# Altium schematic sheet Boost Converter.SchDoc
size A; SheetNumber: 5; SheetTotal: 5
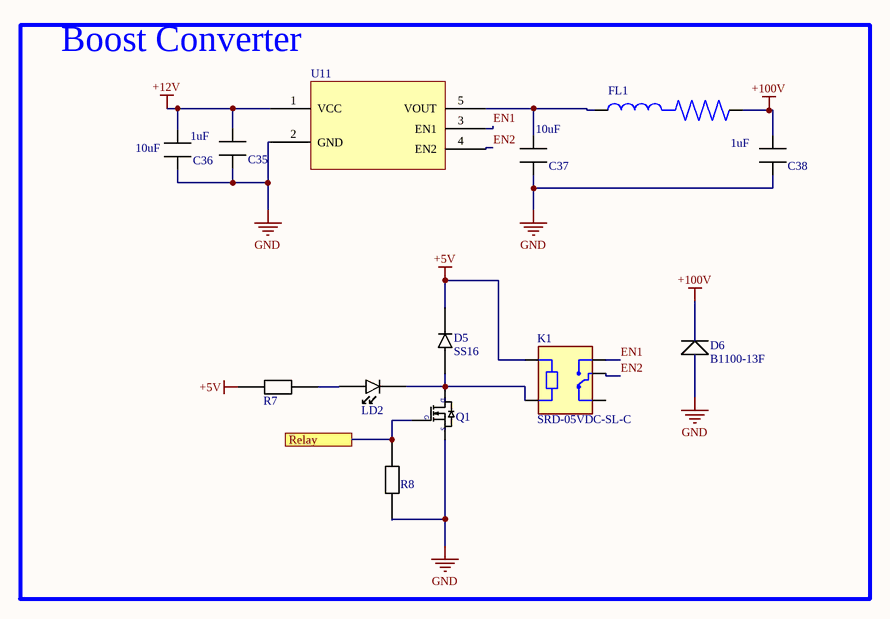
[diagram p0: Boost Converter.SchDoc]

## Parts
C35  1uF  [CAP_1206]
C36  10uF  [CAP_0805]
C37  10uF  [CAP_1206]
C38  1uF  [CAP_1206]
D5  SS16  [DO-214AC]
D6  B1100-13F  [DIOM5226X230N]
FL1  (no value)  [BEAD1206S601A40T]
K1  SRD-05VDC-SL-C  [RELAY_SRD-05VDC-SL-C]
LD2  LED_0805  [LED_0805]  (value not drawn)
Q1  DMN3404L-7  [SOT23-3]  (value not drawn)
R7  330  [RES_0805]  (value not drawn)
R8  4.7k  [RES_0805]  (value not drawn)
U11  Boost_Conv_Module  [Boost_Converter]  (value not drawn)

## Blocks framed on the sheet
Boost Converter: C35-C38 D5 D6 FL1 K1 LD2 Q1 R7 R8 U11

## Ports
Relay

## Nets
+5V: D5.1 K1.A1 R7.2
+12V: C35.2 C36.2 U11.1(VCC)
+100V: C38.2 D6.1(-) FL1.2
GND: C35.1 C36.1 C37.1 C38.1 D6.2(+) Q1.2 R8.1 U11.2(GND)
EN1: K1.NO U11.3(EN1)
EN2: K1.COM U11.4(EN2)
Relay: Q1.1 R8.2 ; port Relay
NetC37_2: C37.2 FL1.1 U11.5(VOUT)
NetD5_2: D5.2 K1.A2 LD2.1 Q1.3
NetLD2_2: LD2.2 R7.1

Not connected (* = marked no-connect by the designer): K1 NC

## Notes on the sheet
- (in symbol DMN3404L-7) D; G; S

## Library data of the parts
C35 C37 C38 = CAP_1206: note: any manufacturer
  C35 C38: val: 1uF
  C37: val: 10uF
C36 = CAP_0805: note: any manufacturer; val: 10uF
D5 = SS16: Independent 60V 700mV@1A 1A SMA(DO-214AC) Single Diodes RoHS; note: any manufacturer; val: SS16; sample link: https://www.lcsc.com/product-detail/Schottky-Barrier-Diodes-SBD_GOODWORK-SS16_C2943739.html; unit price: $ 0.0122
FL1 = BEAD1206S601A40T: MF: Murata; MP: BLM03EB500SZ1D; SnapEDA_Link: https://www.snapeda.com/parts/BLM03EB500SZ1D/Murata/view-part/?ref=snap; Package: 0603 Murata; Value: *; Check_prices: https://www.snapeda.com/parts/BLM03EB500SZ1D/Murata/view-part/?ref=eda
K1 = SRD-05VDC-SL-C: 5V Trigger Relay Module For Arduino And Raspberry Pi 5V Trigger Relay Module For Arduino And Raspberry Pi; MF: Songle Relay; Check_prices: https://www.snapeda.com/parts/SRD-05VDC-SL-C/Songle+Relay/view-part/?ref=eda; Value: *; Availability: Not in stock; Price: None; Package: NON STANDARD-5 Songle Relay; MP: SRD-05VDC-SL-C; SnapEDA_Link: https://www.snapeda.com/parts/SRD-05VDC-SL-C/Songle+Relay/view-part/?ref=snap
Q1 = DMN3404L-7: N-Channel 30V 5.8A 1.4W Surface Mount SOT-23; note: Original; val: DMN3404L-7; sample link: https://www.lcsc.com/product-detail/MOSFETs_Diodes-Incorporated-DMN3404L-7_C155257.html; unit price: $ 0.1522
R7 R8 = RES_0805: note: any manufacturer
  R7: val: 330
  R8: val: 4.7k
U11 = Boost_Converter